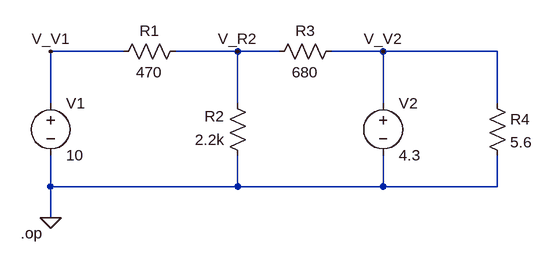
[diagram p0: schematic 1.8.asc]
1.8.asc, the LTspice schematic file:
Version 4
SHEET 1 880 680
WIRE 48 176 -64 176
WIRE 224 176 128 176
WIRE 288 176 224 176
WIRE 448 176 368 176
WIRE 624 176 448 176
WIRE -64 256 -64 176
WIRE 224 256 224 176
WIRE 448 256 448 176
WIRE 624 256 624 176
WIRE -64 384 -64 336
WIRE 224 384 224 336
WIRE 224 384 -64 384
WIRE 448 384 448 336
WIRE 448 384 224 384
WIRE 624 384 624 336
WIRE 624 384 448 384
WIRE -64 432 -64 384
FLAG -64 432 0
FLAG -64 176 V_V1
FLAG 224 176 V_R2
FLAG 448 176 V_V2
SYMBOL voltage -64 240 R0
SYMATTR InstName V1
SYMATTR Value 10
SYMBOL res 144 160 R90
WINDOW 0 0 56 VBottom 2
WINDOW 3 32 56 VTop 2
SYMATTR InstName R1
SYMATTR Value 470
SYMBOL res 240 352 R180
WINDOW 0 36 76 Left 2
WINDOW 3 36 40 Left 2
SYMATTR InstName R2
SYMATTR Value 2.2k
SYMBOL res 384 160 R90
WINDOW 0 0 56 VBottom 2
WINDOW 3 32 56 VTop 2
SYMATTR InstName R3
SYMATTR Value 680
SYMBOL voltage 448 240 R0
SYMATTR InstName V2
SYMATTR Value 4.3
SYMBOL res 608 240 R0
SYMATTR InstName R4
SYMATTR Value 5.6
TEXT -110 456 Left 2 !.op

The netlist it stands for:
* 1.8.asc
V1 V_V1 0 10
R1 V_R2 V_V1 470
R2 0 V_R2 2.2k
R3 V_V2 V_R2 680
V2 V_V2 0 4.3
R4 V_V2 0 5.6
.op
.backanno
.end